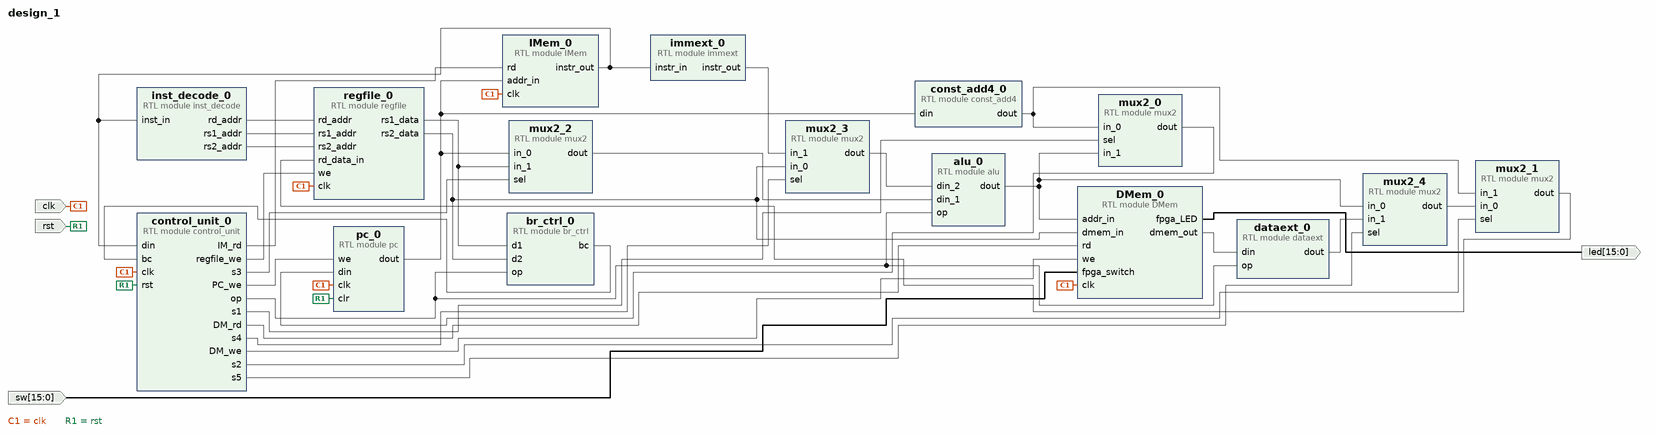
[diagram p0: block diagram of the top level]
# Vivado block design design_1, xc7a35ticpg236-1L, Vivado 2022.1.2
create_bd_design design_1

create_bd_port -dir I -type clk clk
set_property -dict {CONFIG.FREQ_HZ 100000000} [get_bd_ports clk]
create_bd_port -dir I -type rst rst
set_property -dict {CONFIG.POLARITY ACTIVE_HIGH} [get_bd_ports rst]
create_bd_port -dir I -from 15 -to 0 -type data sw
create_bd_port -dir O -from 15 -to 0 -type data led

create_bd_cell -type module -reference regfile regfile_0
create_bd_cell -type module -reference IMem IMem_0
create_bd_cell -type module -reference pc pc_0
create_bd_cell -type module -reference inst_decode inst_decode_0
create_bd_cell -type module -reference br_ctrl br_ctrl_0
create_bd_cell -type module -reference alu alu_0
create_bd_cell -type module -reference mux2 mux2_0
create_bd_cell -type module -reference mux2 mux2_1
create_bd_cell -type module -reference mux2 mux2_2
create_bd_cell -type module -reference mux2 mux2_3
create_bd_cell -type module -reference mux2 mux2_4
create_bd_cell -type module -reference dataext dataext_0
create_bd_cell -type module -reference const_add4 const_add4_0
create_bd_cell -type module -reference immext immext_0
create_bd_cell -type module -reference control_unit control_unit_0
create_bd_cell -type module -reference DMem DMem_0

# ---- connections ----

connect_bd_net [get_bd_pins DMem_0/dmem_out] [get_bd_pins dataext_0/din]
connect_bd_net [get_bd_pins DMem_0/fpga_LED] [get_bd_ports led]
connect_bd_net [get_bd_pins IMem_0/instr_out] [get_bd_pins inst_decode_0/inst_in] [get_bd_pins immext_0/instr_in] [get_bd_pins control_unit_0/din]
connect_bd_net [get_bd_pins alu_0/dout] [get_bd_pins mux2_0/in_1] [get_bd_pins mux2_4/in_0] [get_bd_pins DMem_0/addr_in]
connect_bd_net [get_bd_pins br_ctrl_0/bc] [get_bd_pins control_unit_0/bc]
connect_bd_net [get_bd_ports clk] \
  [get_bd_pins pc_0/clk] [get_bd_pins regfile_0/clk] [get_bd_pins IMem_0/clk] [get_bd_pins control_unit_0/clk] \
  [get_bd_pins DMem_0/clk]
connect_bd_net -net const_add4_0_out [get_bd_pins const_add4_0/dout] [get_bd_pins mux2_0/in_0] [get_bd_pins mux2_1/in_1]
connect_bd_net [get_bd_pins control_unit_0/DM_rd] [get_bd_pins DMem_0/rd]
connect_bd_net [get_bd_pins control_unit_0/DM_we] [get_bd_pins DMem_0/we]
connect_bd_net [get_bd_pins control_unit_0/IM_rd] [get_bd_pins IMem_0/rd]
connect_bd_net [get_bd_pins control_unit_0/PC_we] [get_bd_pins pc_0/we]
connect_bd_net [get_bd_pins control_unit_0/op] [get_bd_pins br_ctrl_0/op] [get_bd_pins alu_0/op] [get_bd_pins dataext_0/op]
connect_bd_net [get_bd_pins control_unit_0/regfile_we] [get_bd_pins regfile_0/we]
connect_bd_net [get_bd_pins control_unit_0/s1] [get_bd_pins mux2_0/sel]
connect_bd_net [get_bd_pins control_unit_0/s2] [get_bd_pins mux2_1/sel]
connect_bd_net [get_bd_pins control_unit_0/s3] [get_bd_pins mux2_2/sel]
connect_bd_net [get_bd_pins control_unit_0/s4] [get_bd_pins mux2_3/sel]
connect_bd_net [get_bd_pins control_unit_0/s5] [get_bd_pins mux2_4/sel]
connect_bd_net [get_bd_pins dataext_0/dout] [get_bd_pins mux2_4/in_1]
connect_bd_net [get_bd_pins immext_0/instr_out] [get_bd_pins mux2_3/in_1]
connect_bd_net [get_bd_pins inst_decode_0/rd_addr] [get_bd_pins regfile_0/rd_addr]
connect_bd_net [get_bd_pins inst_decode_0/rs1_addr] [get_bd_pins regfile_0/rs1_addr]
connect_bd_net [get_bd_pins inst_decode_0/rs2_addr] [get_bd_pins regfile_0/rs2_addr]
connect_bd_net [get_bd_pins mux2_0/dout] [get_bd_pins pc_0/din]
connect_bd_net [get_bd_pins mux2_1/dout] [get_bd_pins regfile_0/rd_data_in]
connect_bd_net [get_bd_pins mux2_2/dout] [get_bd_pins alu_0/din_1]
connect_bd_net [get_bd_pins mux2_3/dout] [get_bd_pins alu_0/din_2]
connect_bd_net [get_bd_pins mux2_4/dout] [get_bd_pins mux2_1/in_0]
connect_bd_net [get_bd_pins pc_0/dout] [get_bd_pins IMem_0/addr_in] [get_bd_pins mux2_2/in_0] [get_bd_pins const_add4_0/din]
connect_bd_net [get_bd_pins regfile_0/rs1_data] [get_bd_pins br_ctrl_0/d1] [get_bd_pins mux2_2/in_1]
connect_bd_net [get_bd_pins regfile_0/rs2_data] [get_bd_pins br_ctrl_0/d2] [get_bd_pins mux2_3/in_0] [get_bd_pins DMem_0/dmem_in]
connect_bd_net [get_bd_ports rst] [get_bd_pins pc_0/clr] [get_bd_pins control_unit_0/rst]
connect_bd_net [get_bd_ports sw] [get_bd_pins DMem_0/fpga_switch]

validate_bd_design
save_bd_design
